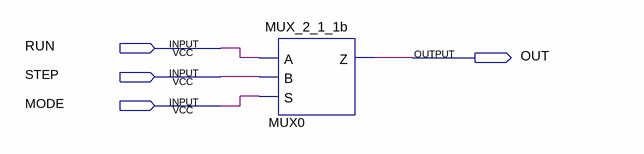
[diagram p0: schematic sheet]
// Quartus schematic RUN_STEP_MODE.bdf as structural Verilog: 1 symbols, 4 pins
module RUN_STEP_MODE (
  input  RUN,
  input  STEP,
  input  MODE,
  output OUT
);

  MUX_2_1_1b MUX0 (.A(RUN), .B(STEP), .S(MODE), .Z(OUT));
endmodule
